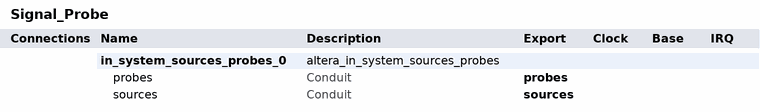
[diagram p0: system contents]
# Platform Designer (Qsys) system Signal_Probe, MAX V 5M570ZT100C5
# Parameters at their usual value, and those the tool derives, are not listed.
package require -exact qsys 16.1
create_system Signal_Probe
set_project_property DEVICE_FAMILY {MAX V}
set_project_property DEVICE 5M570ZT100C5

add_instance in_system_sources_probes_0 altera_in_system_sources_probes 16.1
set_instance_property in_system_sources_probes_0 AUTO_EXPORT true
set_instance_parameter_value in_system_sources_probes_0 create_source_clock false
set_instance_parameter_value in_system_sources_probes_0 instance_id 99
set_instance_parameter_value in_system_sources_probes_0 probe_width 1
set_instance_parameter_value in_system_sources_probes_0 source_width 1

# exported interfaces
add_interface probes conduit end
set_interface_property probes EXPORT_OF in_system_sources_probes_0.probes
add_interface sources conduit end
set_interface_property sources EXPORT_OF in_system_sources_probes_0.sources

set_interconnect_requirement {$system} qsys_mm.clockCrossingAdapter HANDSHAKE
set_interconnect_requirement {$system} qsys_mm.enableEccProtection FALSE
set_interconnect_requirement {$system} qsys_mm.insertDefaultSlave FALSE
set_interconnect_requirement {$system} qsys_mm.maxAdditionalLatency 1

save_system Signal_Probe.qsys
